# EasyEDA Pro project FLIGHT-CONTROLLER_VERSION-2.eprj

# Schematic FLIGHT CONTROLLER
Board Name: FLIGHT CONTROLLER; Create Date: 2025-07-11; Page Name: Sheet_1; Project Name: FLIGHT-CONTROLLER; Schematic Name: FLIGHT CONTROLLER; Update Date: 2025-07-13; Add into BOM: yes; Company: Your Company; Convert to PCB: yes; Date: 2025-07-08; Draw By: Jinalka Herath; REV: 1.0; Sheet: 1/1; spicePre: .
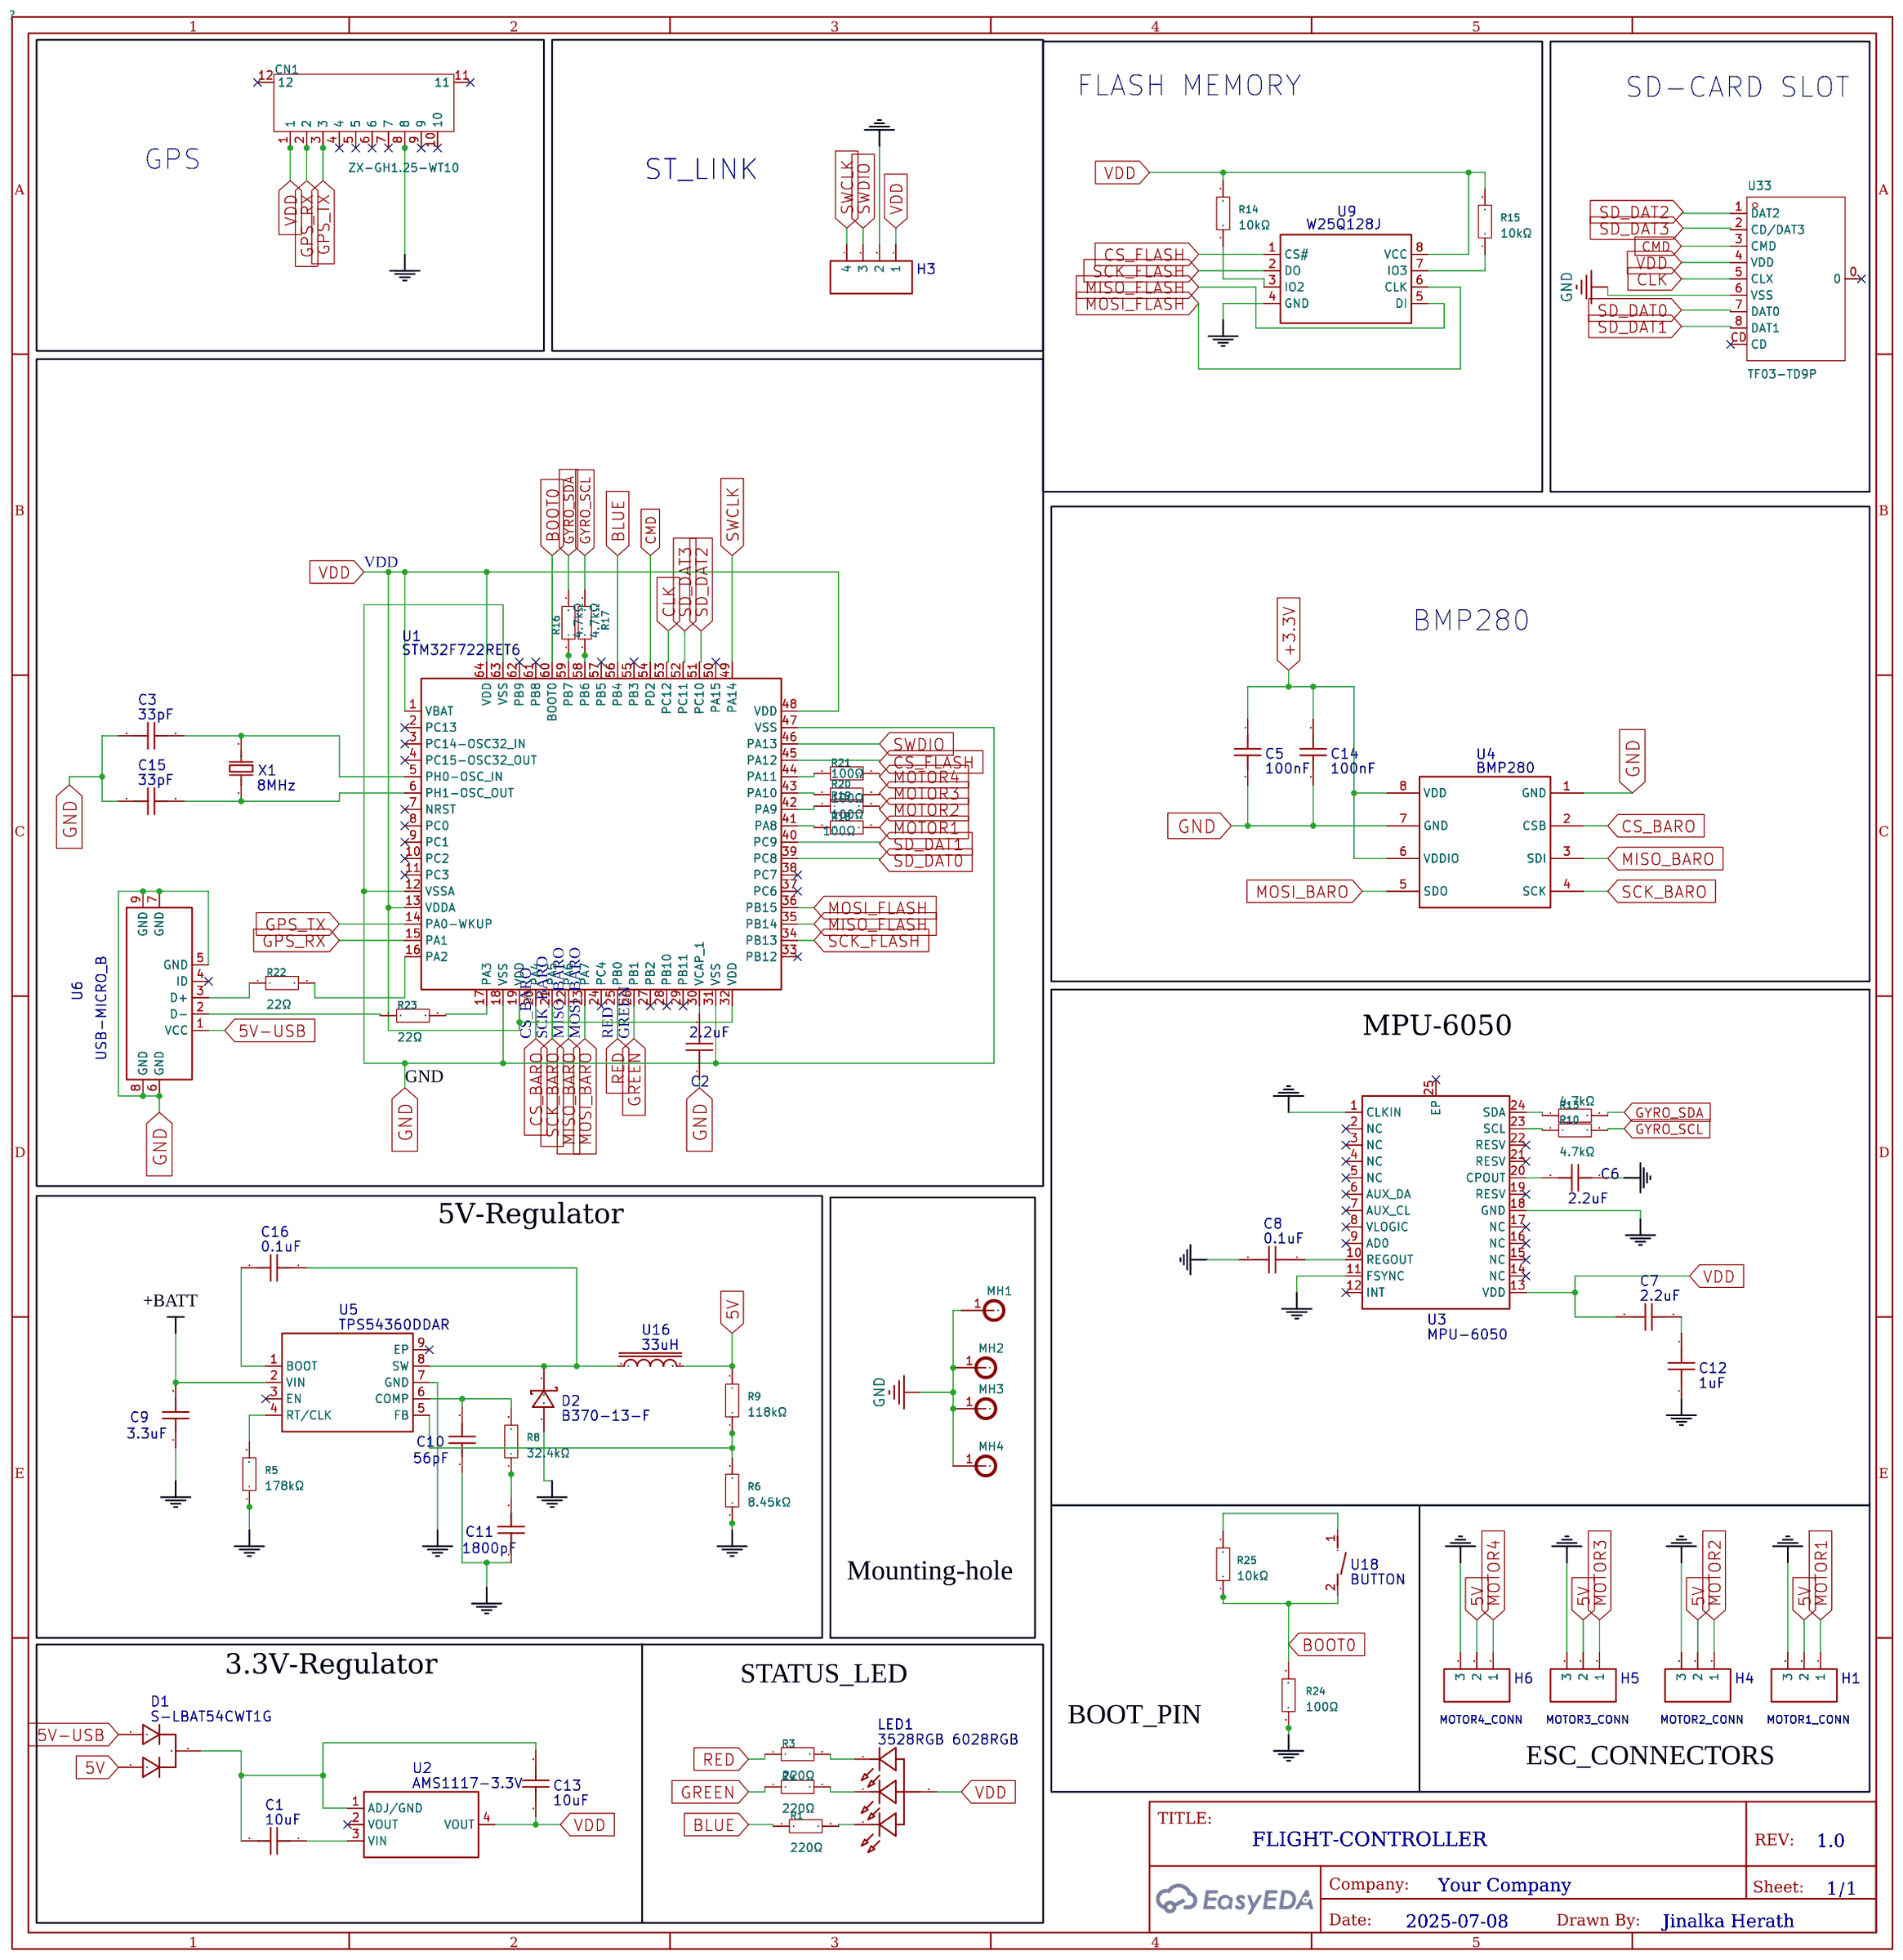
[diagram p0: schematic sheet]

## Parts
C1  10uF  [C0603]
C2  2.2uF  [CAP-SMD_L3.2-W2.5-1]
C3  33pF  [C0603]
C5  100nF  [C0603]
C6  2.2uF  [C0603]
C7  2.2uF  [C0603]
C8  0.1uF  [C0603]
C9  3.3uF  [C0603]
C10  56pF  [C0603]
C11  1800pF  [C0603]
C12  1uF  [C0603]
C13  10uF  [C0603]
C14  100nF  [C0603]
C15  33pF  [C0603]
C16  0.1uF  [C0603]
CN1  ZX-GH1.25-WT10  [CONN-SMD_ZX-GH1.25-WT10]
D1  S-LBAT54CWT1G  [SC-70-3_L2.0-W1.3-P1.30-LS2.1-BR]
D2  B370-13-F  [SMC_L7.1-W6.2-LS8.1-RD]
H1  MOTOR1_CONN  [HDR-F-2.54_1X3]
H3  ST_LINK  [HDR-F-2.54_1X4]
H4  MOTOR2_CONN  [HDR-F-2.54_1X3]
H5  MOTOR3_CONN  [HDR-F-2.54_1X3]
H6  MOTOR4_CONN  [HDR-F-2.54_1X3]
LED1  3528RGB 6028RGB  [LED-SMD_4P-L3.5-W2.8_3528RGB-6028RGB]
MH1  -  [MH_7.5]  (no BOM)
MH2  -  [MH_7.5]  (no BOM)
MH3  -  [MH_7.5]  (no BOM)
MH4  -  [MH_7.5]  (no BOM)
R1  220Ω  [R0805]
R3  220Ω  [R0805]
R4  220Ω  [R0805]
R5  178kΩ  [R0805]
R6  8.45kΩ  [R0805]
R8  32.4kΩ  [R0805]
R9  118kΩ  [R0805]
R10  4.7kΩ  [R0805]
R13  4.7kΩ  [R0805]
R14  10kΩ  [R0805]
R15  10kΩ  [R0805]
R16  4.7kΩ  [R0805]
R17  4.7kΩ  [R0805]
R18  100Ω  [R0805]
R19  100Ω  [R0805]
R20  100Ω  [R0805]
R21  100Ω  [R0805]
R22  22Ω  [R0805]
R23  22Ω  [R0805]
R24  100Ω  [R0805]
R25  10kΩ  [R0805]
U1  STM32F722RET6  [LQFP-64_L10.0-W10.0-P0.50-LS12.0-BL]
U2  AMS1117-3.3V  [SOT-223-4_L6.5-W3.5-P2.30-LS7.0-BR]
U3  MPU-6050  [QFN-24_L4.0-W4.0-P0.50-BL-EP2.7]
U4  BMP280  [LGA-8_L2.5-W2.0-P0.65_AMP6127]
U5  TPS54360DDAR  [ESOP-8_L4.9-W3.9-P1.27-LS6.0-BL-EP]
U6  USB-MICRO_B  [MICRO-USB-SMD_USB-MICRO_B]
U9  W25Q128J  [SOIC-8_L5.3-W5.3-P1.27-LS8.0-BL]
U16  33uH  [IND-SMD_L8.5-W8.0_SMS0850]
U18  BUTTON  [KEY-SMD_L6.0-W6.0-LS6.6]
U33  TF03-TD9P  [CONN-SMD_TF-001A-P]
X1  8MHz  [CRYSTAL-SMD_L3.2-W2.5_3225-8MHZ]

## Library data of the parts
C1 C13 = 10uF: Supplier: LCSC; Supplier Part: C3884822; Manufacturer: TDK; Manufacturer Part: C1608CH2A560J080AA; JLCPCB Part Class: Extended Part; Contributor: lcsc; nameAlias: Value; spicePre: C; spiceSymbolName: C1608CH2A560J080AA
C2 = 2.2uF: Supplier: LCSC; Supplier Part: C3778570; Manufacturer: rubycon(红宝石); Manufacturer Part: 25MU225MB23225; JLCPCB Part Class: Extended Part; Contributor: lcsc; nameAlias: Value; spicePre: C; spiceSymbolName: 25MU225MB23225
C3 C15 = 33pF: Supplier: LCSC; Supplier Part: C3884822; Manufacturer: TDK; Manufacturer Part: C1608CH2A560J080AA; JLCPCB Part Class: Extended Part; Contributor: lcsc; nameAlias: Value; spicePre: C; spiceSymbolName: C1608CH2A560J080AA
C5 C14 = 100nF: Supplier: LCSC; Supplier Part: C3884822; Manufacturer: TDK; Manufacturer Part: C1608CH2A560J080AA; JLCPCB Part Class: Extended Part; Contributor: lcsc; nameAlias: Value; spicePre: C; spiceSymbolName: C1608CH2A560J080AA
C6 C7 = 2.2uF: Supplier: LCSC; Supplier Part: C3884822; Manufacturer: TDK; Manufacturer Part: C1608CH2A560J080AA; JLCPCB Part Class: Extended Part; Contributor: lcsc; nameAlias: Value; spicePre: C; spiceSymbolName: C1608CH2A560J080AA
C8 C16 = 0.1uF: Supplier: LCSC; Supplier Part: C3884822; Manufacturer: TDK; Manufacturer Part: C1608CH2A560J080AA; JLCPCB Part Class: Extended Part; Contributor: lcsc; nameAlias: Value; spicePre: C; spiceSymbolName: C1608CH2A560J080AA
C9 = 3.3uF: Supplier: LCSC; Supplier Part: C3884822; Manufacturer: TDK; Manufacturer Part: C1608CH2A560J080AA; JLCPCB Part Class: Extended Part; Contributor: lcsc; nameAlias: Value; spicePre: C; spiceSymbolName: C1608CH2A560J080AA
C10 = 56pF: Supplier: LCSC; Supplier Part: C3884822; Manufacturer: TDK; Manufacturer Part: C1608CH2A560J080AA; JLCPCB Part Class: Extended Part; Contributor: lcsc; nameAlias: Value; spicePre: C; spiceSymbolName: C1608CH2A560J080AA
C11 = 1800pF: Supplier: LCSC; Supplier Part: C3884822; Manufacturer: TDK; Manufacturer Part: C1608CH2A560J080AA; JLCPCB Part Class: Extended Part; Contributor: lcsc; nameAlias: Value; spicePre: C; spiceSymbolName: C1608CH2A560J080AA
C12 = 1uF: Supplier: LCSC; Supplier Part: C3884822; Manufacturer: TDK; Manufacturer Part: C1608CH2A560J080AA; JLCPCB Part Class: Extended Part; Contributor: lcsc; nameAlias: Value; spicePre: C; spiceSymbolName: C1608CH2A560J080AA
CN1 = ZX-GH1.25-WT10: Pins Structure:1x10P Pitch:1.25mm Mounting Type:Surface Mount, Right Angle Reference Series:GH Number of Pins:10P Number of Rows:1 Number of PINs Per Row:10 Row Spacing:- Current Rating:1A Contact Material:Phosphor Bronze Contact Plating:Tin Operating Tem; LCSC Part Name: 1x10P 间距:1.25mm 卧贴 系列:GH; Supplier Part: C7429523; Manufacturer: Megastar(兆星); Supplier Footprint: SMD,P=1.25mm,卧贴; JLCPCB Part Class: Extended Part; Datasheet: https://atta.szlcsc.com/upload/public/pdf/source/20230619/4B2B28B10338DA0EF18CC8BF26211619.pdf; Supplier: LCSC; Pins Structure: 1x10P; Pitch: 1.25mm; Mounting Type: Surface Mount, Right Angle; Reference Series: GH; Number of Pins: 10P; Number of Rows: 1; Number of PINs Per Row: 10; Current Rating: 1A; Contact Material: Phosphor Bronze; Contact Plating: Tin; Operating Temperature: -25℃~+85℃; Voltage Rating: 125V; Plastic Material: LCP; Supplementary Features: Auxiliary Solder Pin; Color: Beige; Z-Height of the Board: 4.35mm; X-Length of Bottom Edge on Board (Spacing Line): 15.75mm; Y-Width of Bottom Edge on Board: 5mm
D1 = S-LBAT54CWT1G: Supplier: LCSC; Supplier Part: C2941716; Manufacturer: LRC(乐山无线电); JLCPCB Part Class: Extended Part; Contributor: lcsc; spicePre: D
D2 = B370-13-F: Supplier Part: C134456; Supplier: LCSC; Manufacturer: DIODES(美台); JLCPCB Part Class: Extended Part; Contributor: LCSC; spicePre: D
H1 = MOTOR1_CONN: Supplier Part: C146690; Supplier: LCSC; Contributor: LCEDA_Lib; spicePre: H; spiceSymbolName: HDR-F-2.54_1x3
H3 = ST_LINK: Supplier Part: C225501; Supplier: LCSC; Contributor: LCEDA_Lib; spicePre: H; spiceSymbolName: HDR-F-2.54_1x4
H4 = MOTOR2_CONN: Supplier Part: C146690; Supplier: LCSC; Contributor: LCEDA_Lib; spicePre: H; spiceSymbolName: HDR-F-2.54_1x3
H5 = MOTOR3_CONN: Supplier Part: C146690; Supplier: LCSC; Contributor: LCEDA_Lib; spicePre: H; spiceSymbolName: HDR-F-2.54_1x3
H6 = MOTOR4_CONN: Supplier Part: C146690; Supplier: LCSC; Contributor: LCEDA_Lib; spicePre: H; spiceSymbolName: HDR-F-2.54_1x3
LED1 = 3528RGB 6028RGB: Supplier: LCSC; Supplier Part: C9900020542; Manufacturer: null; Manufacturer Part: 3528反贴RGB 6028反贴RGB 缺口蓝色; JLCPCB Part Class: Extended Part; Contributor: lcsc; spicePre: L
MH1-MH4 = MH_7.5
R1 R3-R6 R8-R10 R13-R25 = 0805W8F2200T5E: Type:Thick Film Resistors Resistance: Tolerance:±1% Tolerance:±1% Power(Watts): Overload Voltage (Max): Temperature Coefficient:±100ppm/℃ Temperature Coefficient:±100ppm/℃ Operating Temperature Range:-55℃~+155℃ Operating Temperature Range:-55℃~+155℃; LCSC Part Name: 220Ω ±1% 125mW 厚膜电阻; Supplier Part: C17557; Manufacturer: UNI-ROYAL(厚声); Supplier Footprint: 0805; JLCPCB Part Class: Basic Part; Datasheet: https://atta.szlcsc.com/upload/public/pdf/source/20200306/C422600_1E6D84923E4A46A82E41ADD87F860B5C.pdf; Supplier: LCSC; Type: Thick Film Resistors; Tolerance: ±1%; Temperature Coefficient: ±100ppm/℃; Operating Temperature Range: -55℃~+155℃
U1 = STM32F722RET6: Supplier: LCSC; Supplier Part: C118207; Manufacturer: ST(意法半导体); JLCPCB Part Class: Extended Part; Contributor: LCSC; spicePre: U
U2 = AMS1117-3.3V: Supplier: LCSC; Supplier Part: C2688239; Manufacturer: WPMtek(维攀); JLCPCB Part Class: Extended Part; Contributor: LCSC; spicePre: U
U3 = MPU-6050_C24112: Supplier: LCSC; Manufacturer: TDK InvenSense(应美盛); Supplier Part: C24112; JLCPCB Part Class: Extended Part; sourceId: 1T5FDZYC8; timeStamp: 1462265206; spicePre: U
U4 = BMP280: Supplier: LCSC; Manufacturer: Bosch(博世); Supplier Part: C83291; JLCPCB Part Class: Extended Part; spicePre: U
U5 = TPS54360DDAR(TOKMAS): Supplier: LCSC; Supplier Part: C7525413; Manufacturer: Tokmas(托克马斯); JLCPCB Part Class: Extended Part; Contributor: lcsc; spicePre: U
U6 = USB-MICRO_B: Supplier: LCSC; Supplier Part: C9900001367; Manufacturer: null; JLCPCB Part Class: Extended Part; Contributor: LCSC; spicePre: U
U9 = W25Q128JVSIQTR: Supplier: LCSC; Manufacturer: WINBOND(华邦); Manufacturer Part: W25Q128JVSIQ; Supplier Part: C97521; JLCPCB Part Class: Basic Part; spicePre: U
U16 = 33uH: Supplier: LCSC; Supplier Part: C7602869; Manufacturer: LanTu Micro(蓝图微电); Manufacturer Part: SMS0850-330MT; JLCPCB Part Class: Extended Part; nameAlias: Value; Contributor: lcsc; spicePre: U; spiceSymbolName: SMS0850-330MT
U18 = BUTTON: Supplier: LCSC; Supplier Part: C9900040040; Manufacturer: null; JLCPCB Part Class: Extended Part; Contributor: lcsc; spicePre: U; spiceSymbolName: BUTTON_C9900040040
U33 = TF03-TD9P: LCSC Part Name: 自弹式 MicroSD(TF卡）卡座; Supplier Part: C36936584; Manufacturer: BXCONN(宝讯); Supplier Footprint: SMD; Datasheet: https://atta.szlcsc.com/upload/public/pdf/source/20240731/E1986EBDAECF71B60F867BC7213E5175.pdf; Supplier: LCSC
X1 = 8MHz: Supplier: LCSC; Supplier Part: C42448903; Manufacturer: YXC(扬兴晶振); Manufacturer Part: X22EL89COI-111YLC-8M; JLCPCB Part Class: Extended Part; Contributor: lcsc; nameAlias: Value; spicePre: X; spiceSymbolName: X22EL89COI-111YLC-8M

## Nets
5V: D1.2 H1.2 H4.2 H5.2 H6.2 R9.2 U16.2
5V-USB: D1.1 U6.1(VCC)
+3.3V: C5.1 C14.1 U4.6(VDDIO) U4.8(VDD)
GND: C2.1 C3.1 C5.2 C6.1 C8.2 C9.1 C10.1 C11.1 C12.2 C14.2 C15.1 CN1.8 D2.2(A) H1.3 H3.2 H4.3 H5.3 H6.3 MH1.1 MH2.1 MH3.1 MH4.1 R5.1 R6.1 R24.1 U1.12(VSSA) U1.18(VSS) U1.31(VSS) U1.47(VSS) U1.63(VSS) U3.1(CLKIN) U3.11(FSYNC) U3.18(GND) U4.1(GND) U4.7(GND) U5.7(GND) U6.5(GND) U6.6(GND) U6.7(GND) U6.8(GND) U6.9(GND) U9.4(GND) U33.6(VSS)
VDD: C7.2 C13.2 CN1.1 H3.1 LED1.3(A) R14.2 R15.2 U1.1(VBAT) U1.13(VDDA) U1.19(VDD) U1.32(VDD) U1.48(VDD) U1.64(VDD) U2.4(VOUT) U3.13(VDD) U9.8(VCC) U33.4(VDD)
+BATT: C9.2 U5.2(VIN)
BLUE: R1.1 U1.56(PB4)
BOOT0: R24.2 R25.1 U1.60(BOOT0) U18.2(B)
CLK: U1.53(PC12) U33.5(CLX)
CMD: U1.54(PD2) U33.3(CMD)
CS_BARO: U1.20(PA4) U4.2(CSB)
CS_FLASH: U1.45(PA12) U9.1(CS#)
GPS_RX: CN1.2 U1.15(PA1)
GPS_TX: CN1.3 U1.14(PA0-WKUP)
GREEN: R4.1 U1.26(PB1)
GYRO_SCL: R10.2 R17.2
GYRO_SDA: R13.2 R16.2
MISO_BARO: U1.22(PA6) U4.3(SDI)
MISO_FLASH: U1.35(PB14) U9.5(DI)
MOSI_BARO: U1.23(PA7) U4.5(SDO)
MOSI_FLASH: U1.36(PB15) U9.6(CLK)
MOTOR1: H1.1 R18.2
MOTOR2: H4.1 R19.2
MOTOR3: H5.1 R20.2
MOTOR4: H6.1 R21.2
RED: R3.1 U1.25(PB0)
SCK_BARO: U1.21(PA5) U4.4(SCK)
SCK_FLASH: U1.34(PB13) U9.2(DO)
SD_DAT0: U1.39(PC8) U33.7(DAT0)
SD_DAT1: U1.40(PC9) U33.8(DAT1)
SD_DAT2: U1.51(PC10) U33.1(DAT2)
SD_DAT3: U1.52(PC11) U33.2(CD/DAT3)
SWCLK: H3.4 U1.49(PA14)
SWDIO: H3.3 U1.46(PA13)
$1N7: C2.2 U1.30(VCAP_1)
$1N9: C3.2 U1.5(PH0-OSC_IN) X1.2
$1N10: C15.2 U1.6(PH1-OSC_OUT) X1.1
$1N15: C8.1 U3.10(REGOUT)
$1N18: C7.1 C12.1
$1N20: C6.2 U3.20(CPOUT)
$1N23: C1.2 C13.1 D1.3 U2.1(ADJ/GND)
$1N24: C1.1 U2.3(VIN)
$1N83: C16.2 U5.1(BOOT)
$1N84: C16.1 D2.1(C) U5.8(SW) U16.1
Net-(C10-2): C10.2 R8.2 U5.6(COMP)
Net-(C11-2): C11.2 R8.1
Net-(LED1-1): LED1.1(B) R4.2
Net-(LED1-2): LED1.2(R) R3.2
Net-(LED1-4): LED1.4(G) R1.2
Net-(R5-2): R5.2 U5.4(RT/CLK)
Net-(R6-2): R6.2 R9.1 U5.5(FB)
Net-(R10-1): R10.1 U3.23(SCL)
Net-(R13-1): R13.1 U3.24(SDA)
Net-(R14-1): R14.1 U9.3(IO2)
Net-(R15-1): R15.1 U9.7(IO3)
Net-(R16-1): R16.1 U1.59(PB7)
Net-(R17-1): R17.1 U1.58(PB6)
Net-(R18-1): R18.1 U1.41(PA8)
Net-(R19-1): R19.1 U1.42(PA9)
Net-(R20-1): R20.1 U1.43(PA10)
Net-(R21-1): R21.1 U1.44(PA11)
Net-(R22-1): R22.1 U6.3(D+)
Net-(R22-2): R22.2 U1.16(PA2)
Net-(R23-1): R23.1 U6.2(D-)
Net-(R23-2): R23.2 U1.17(PA3)
Net-(R25-2): R25.2 U18.1(A)

Not connected (* = marked no-connect by the designer): CN1 4* 5* 6* 7* 9* 10* 11* 12*; U1 2(PC13)* 3(PC14-OSC32_IN)* 4(PC15-OSC32_OUT)* 7(NRST)* 8(PC0)* 9(PC1)* 10(PC2)* 11(PC3)* 24(PC4)* 27(PB2)* 28(PB10)* 29(PB11)* 33(PB12)* 37(PC6)* 38(PC7)* 50(PA15)* 55(PB3)* 57(PB5)* 61(PB8)* 62(PB9)*; U2 2(VOUT)*; U3 2(NC)* 3(NC)* 4(NC)* 5(NC)* 6(AUX_DA)* 7(AUX_CL)* 8(VLOGIC)* 9(AD0)* 12(INT)* 14(NC)* 15(NC)* 16(NC)* 17(NC)* 19(RESV)* 21(RESV)* 22(RESV)* 25(EP)*; U5 3(EN)* 9(EP)*; U6 4(ID)*; U33 0* CD*

## Notes on the sheet
- FLASH MEMORY
- SD-CARD SLOT
- GPS
- BMP280
- MPU-6050
- 5V-Regulator
- +BATT
- Mounting-hole
- 3.3V-Regulator
- STATUS_LED
- BOOT_PIN
- ESC_CONNECTORS

# Board PCB4
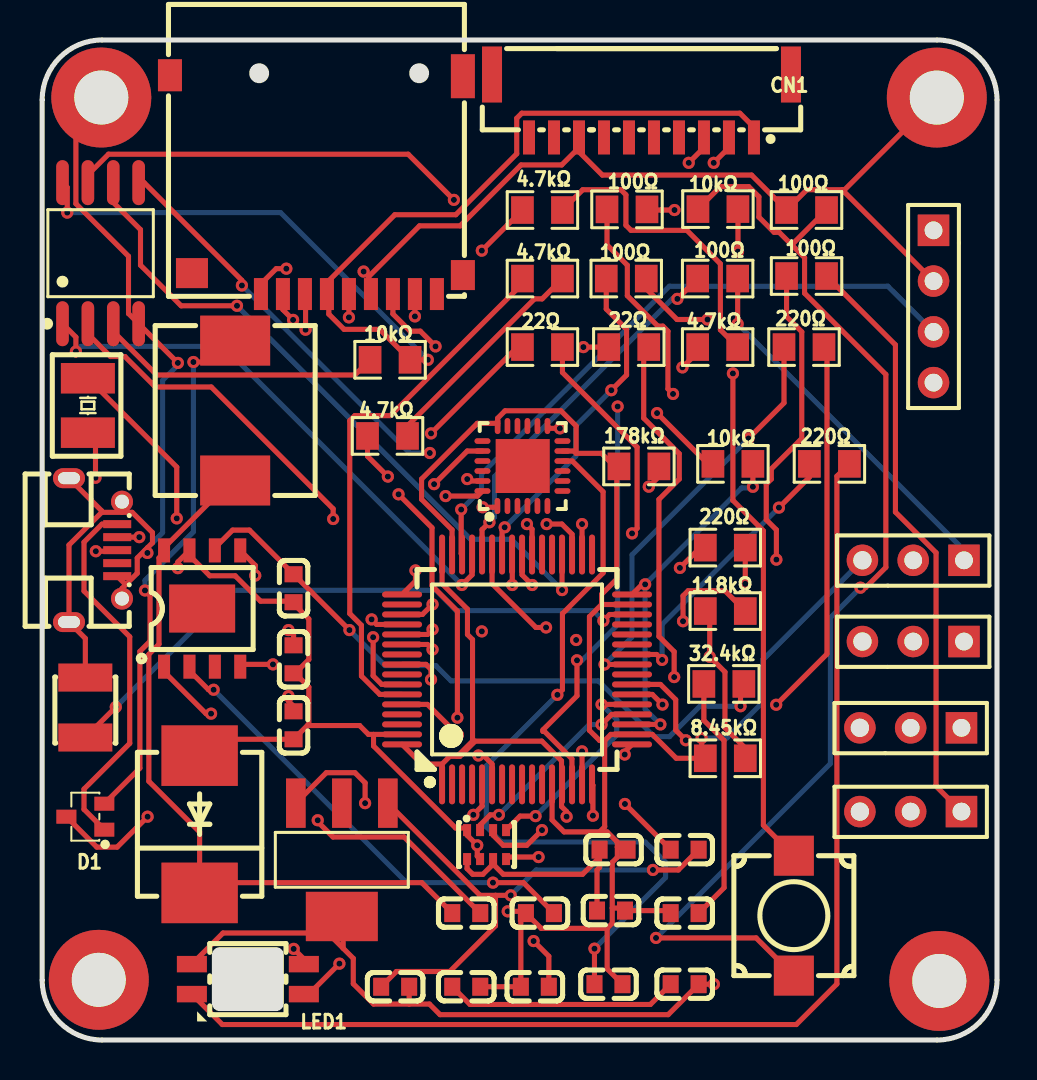
[diagram p1: board, top side]
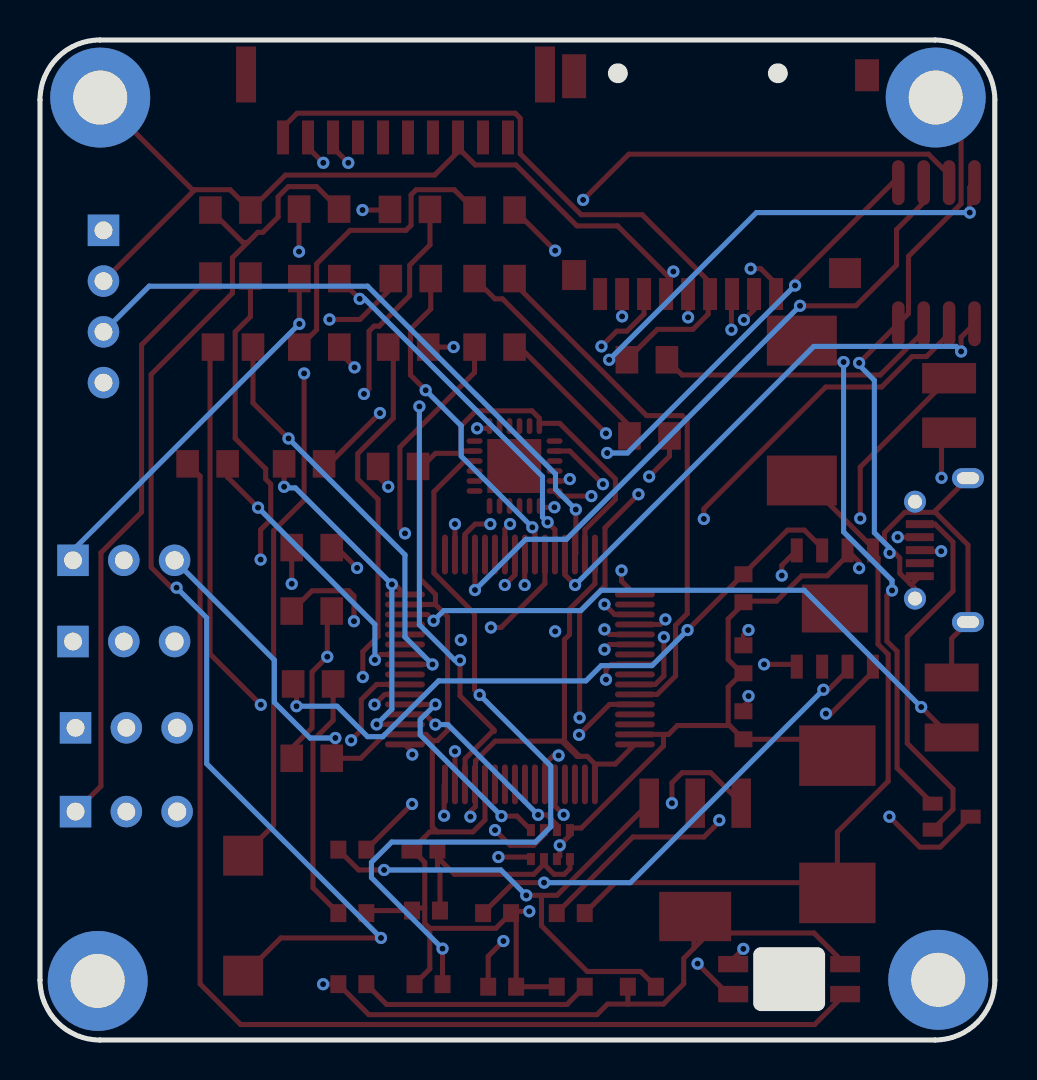
[diagram p2: board, bottom side, seen from below]

Outline 47.75 x 50.04 mm; copper layers: Top Layer, Inner1, Inner2, Bottom Layer. Coordinates in mm from the lower left corner of the outline.
Outline path: 0,47.04 0,3 arc(0.88,0.88) 3,0 44.75,0 arc(46.87,0.88) 47.75,3 47.75,47.04 arc(46.87,49.16) 44.75,50.04 3,50.04 arc(0.88,49.16) 0,47.04
Stack: Top Layer 0.035mm Outer layer thickness 1oz / Dielectric1 0.2104mm 7628 RC49% 8.6mil / Inner1 0.0152mm Inner layer thickness / Dielectric2 1.065mm 1.1mm H/HOZ Copper / Inner2 0.0152mm Inner layer thickness / Dielectric3 0.2104mm 7628 RC49% 8.6mil / Bottom Layer 0.035mm Outer layer thickness 1oz

## Design rules (mm)
template: JLCPCB Capability(Two Layers Board)
spacing copperThickness1oz (default): track to track 0.102, other pairs 0.152 to 0.3
spacing copperThickness2oz: track to track 0.203, other pairs 0.152 to 0.3
track width copperThickness1oz (default): min 0.127, default 0.254, max 2.54
track width copperThickness2oz: min 0.203, default 0.254, max 2.54
differential pair differentialPair (default): width min 0.127, default 0.254, max 2.54; gap min 0.152, default 0.152
via viaSize (default): diameter min 0.5, default 0.61, max 10; hole min 0.3, default 0.305, max 6.3
pour e16520 uses copperRegion

## Placement (name value [footprint] x y rotation side)
4.7kΩ  -  [R0805]  33.78 34.67 0 top
4.7kΩ#2  -  [R0805]  17.27 30.23 0 top
4.7kΩ#3  -  [R0805]  25.02 38.1 0 top
4.7kΩ#4  -  [R0805]  25.02 41.53 0 top
8.45kΩ  8.45kΩ  [R0805]  34.16 14.1 0 top
10kΩ  -  [R0805]  17.4 34.04 0 top
10kΩ#2  -  [R0805]  34.54 28.83 0 top
10kΩ#3  -  [R0805]  33.8 41.58 0 top
22Ω  -  [R0805]  29.34 34.67 0 top
22Ω#2  -  [R0805]  25.02 34.67 0 top
32.4kΩ  32.4kΩ  [R0805]  34.09 17.82 0 top
100Ω  -  [R0805]  38.23 38.23 0 top
100Ω#2  -  [R0805]  29.21 38.1 0 top
100Ω#3  -  [R0805]  29.25 41.56 0 top
100Ω#4  -  [R0805]  33.78 38.1 0 top
100Ω#5  -  [R0805]  38.23 41.53 0 top
118kΩ  118kΩ  [R0805]  34.16 21.46 0 top
178kΩ  178kΩ  [R0805]  29.85 28.7 0 top
220Ω  -  [R0805]  34.16 24.64 0 top
220Ω#2  -  [R0805]  38.1 34.67 0 top
220Ω#3  -  [R0805]  39.37 28.83 0 top
C1  10uF  [C0603]  32.13 9.53 0 top
C2  2.2uF  [CAP-SMD_L3.2-W2.5-1]  2.16 16.64 270 top
C3  33pF  [C0603]  12.57 19.05 90 top
C5  100nF  [C0603]  28.45 6.48 0 top
C6  2.2uF  [C0603]  24.64 2.67 0 top
C7  2.2uF  [C0603]  32.13 2.79 0 top
C8  0.1uF  [C0603]  28.32 2.79 0 top
C9  3.3uF  [C0603]  24.89 6.35 0 top
C10  56pF  [C0603]  12.57 22.61 90 top
C11  1800pF  [C0603]  32.13 6.35 0 top
C12  1uF  [C0603]  21.21 2.67 0 top
C13  10uF  [C0603]  17.65 2.67 0 top
C14  100nF  [C0603]  28.58 9.53 0 top
C15  33pF  [C0603]  12.57 15.75 90 top
C16  0.1uF  [C0603]  21.21 6.35 0 top
CN1  ZX-GH1.25-WT10  [CONN-SMD_ZX-GH1.25-WT10]  29.97 46.74 180 top
D1  S-LBAT54CWT1G  [SC-70-3_L2.0-W1.3-P1.30-LS2.1-BR]  2.16 11.18 0 top
D2  B370-13-F  [SMC_L7.1-W6.2-LS8.1-RD]  7.87 10.8 90 top
H1  MOTOR1_CONN  [HDR-F-2.54_1X3]  43.43 11.43 180 top
H3  ST_LINK  [HDR-F-2.54_1X4]  44.58 36.7 270 top
H4  MOTOR2_CONN  [HDR-F-2.54_1X3]  43.43 15.62 180 top
H5  MOTOR3_CONN  [HDR-F-2.54_1X3]  43.56 19.94 180 top
H6  MOTOR4_CONN  [HDR-F-2.54_1X3]  43.56 24 180 top
LED1  3528RGB 6028RGB  [LED-SMD_4P-L3.5-W2.8_3528RGB-6028RGB]  10.29 3.05 0 top
MH1  -  [MH_7.5]  2.96 47.54 0 top
MH2  -  [MH_7.5]  44.74 47.54 0 top
MH3  -  [MH_7.5]  44.87 3.34 0 top
MH4  -  [MH_7.5]  2.83 3.39 0 top
U1  STM32F722RET6  [LQFP-64_L10.0-W10.0-P0.50-LS12.0-BL]  23.75 18.54 0 top
U2  AMS1117-3.3V  [SOT-223-4_L6.5-W3.5-P2.30-LS7.0-BR]  14.99 9.02 90 top
U3  MPU-6050  [QFN-24_L4.0-W4.0-P0.50-BL-EP2.7]  24.02 28.72 0 top
U4  BMP280  [LGA-8_L2.5-W2.0-P0.65_AMP6127]  22.23 9.78 90 top
U5  TPS54360DDAR  [ESOP-8_L4.9-W3.9-P1.27-LS6.0-BL-EP]  8 21.59 0 top
U6  USB-MICRO_B  [MICRO-USB-SMD_USB-MICRO_B]  2.67 24.51 270 top
U9  W25Q128J  [SOIC-8_L5.3-W5.3-P1.27-LS8.0-BL]  2.92 39.37 0 top
U16  33uH  [IND-SMD_L8.5-W8.0_SMS0850]  9.65 31.5 90 top
U18  BUTTON  [KEY-SMD_L6.0-W6.0-LS6.6]  37.59 6.22 270 top
U33  TF03-TD9P  [CONN-SMD_TF-001A-P]  13.72 42.8 180 top
X1  8MHz  [CRYSTAL-SMD_L3.2-W2.5_3225-8MHZ]  2.29 31.75 90 top

## Footprints (pads in the part's own frame, mm; a bottom-side part is the same pattern mirrored in y, then rotated)
C0603
  rect 0.8x0.9 smd: 1(-0.7,0) 2(0.7,0)
CAP-SMD_L3.2-W2.5-1
  rect 1.4x2.7 smd: 1(-1.5,0) 2(1.5,0)
CONN-SMD_TF-001A-P
  rect 1.2x1.5 smd: 0(-7.325,4.524)
  rect 1.2x2.2 smd: 0(-7.325,-5.426)
  rect 1.6x1.5 smd: 0(6.225,4.426)
  rect 1.2x1.6 smd: 0(7.325,-5.474)
  rect 0.7x1.6 smd: 1(2.775,5.474) 2(1.675,5.474) 3(0.575,5.474) 4(-0.525,5.474) 5(-1.625,5.474) 6(-2.725,5.474) 7(-3.825,5.474) 8(-4.925,5.474) CD(-6.025,5.474)
CONN-SMD_ZX-GH1.25-WT10
  rect 0.6x1.7 smd: 1(-5.625,1.575) 2(-4.375,1.575) 3(-3.125,1.575) 4(-1.875,1.575) 5(-0.625,1.575) 6(0.625,1.575) 7(1.875,1.575) 8(3.125,1.575) 9(4.375,1.575) 10(5.625,1.575)
  rect 1x2.8 smd: 11(7.475,-1.575) 12(-7.475,-1.575)
CRYSTAL-SMD_L3.2-W2.5_3225-8MHZ
  rect 1.524x2.7 smd: 1(-1.362,0) 2(1.362,0)
ESOP-8_L4.9-W3.9-P1.27-LS6.0-BL-EP
  rect 0.6x1.2 smd: 1(-1.905,-2.909) 2(-0.635,-2.909) 3(0.635,-2.909) 4(1.905,-2.909) 5(1.905,2.909) 6(0.635,2.909) 7(-0.635,2.909) 8(-1.905,2.909)
  rect 3.3x2.4 smd: 9(0,0)
HDR-F-2.54_1X3
  rect 1.575x1.575 hole 0.889: 1(-2.54,0)
  round 1.575 hole 0.889: 2(0,0)
  round 1.575 hole 0.914: 3(2.54,0)
HDR-F-2.54_1X4
  rect 1.575x1.575 hole 0.889: 1(-3.81,0)
  round 1.575 hole 0.889: 2(-1.27,0) 3(1.27,0) 4(3.81,0)
IND-SMD_L8.5-W8.0_SMS0850
  rect 2.5x3.5 smd: 1(-3.5,0) 2(3.5,0)
KEY-SMD_L6.0-W6.0-LS6.6
  rect 2x2 smd: 1(-3,0) 2(3,0)
LED-SMD_4P-L3.5-W2.8_3528RGB-6028RGB
  rect 1.5x0.82 smd: 1(-2.8,-0.75) 2(2.8,-0.75) 3(-2.8,0.75) 4(2.8,0.75)
LGA-8_L2.5-W2.0-P0.65_AMP6127
  rect 0.6x0.4 smd: 1(0.725,0.975) 2(0.725,0.325) 3(0.725,-0.325) 4(0.725,-0.975) 5(-0.725,-0.975) 6(-0.725,-0.325) 7(-0.725,0.325) 8(-0.725,0.975)
LQFP-64_L10.0-W10.0-P0.50-LS12.0-BL
  oval 0.3x2 smd: 1(-3.75,-5.75) 2(-3.25,-5.75) 3(-2.75,-5.75) 4(-2.25,-5.75) 5(-1.75,-5.75) 6(-1.25,-5.75) 7(-0.75,-5.75) 8(-0.25,-5.75) 9(0.25,-5.75) 10(0.75,-5.75) 11(1.25,-5.75) 12(1.75,-5.75) 13(2.25,-5.75) 14(2.75,-5.75) 15(3.25,-5.75) 16(3.75,-5.75) 33(3.75,5.75) 34(3.25,5.75) 35(2.75,5.75) 36(2.25,5.75) 37(1.75,5.75) 38(1.25,5.75) 39(0.75,5.75) 40(0.25,5.75) 41(-0.25,5.75) 42(-0.75,5.75) 43(-1.25,5.75) 44(-1.75,5.75) 45(-2.25,5.75) 46(-2.75,5.75) 47(-3.25,5.75) 48(-3.75,5.75)
  oval 2x0.3 smd: 17(5.75,-3.75) 18(5.75,-3.25) 19(5.75,-2.75) 20(5.75,-2.25) 21(5.75,-1.75) 22(5.75,-1.25) 23(5.75,-0.75) 24(5.75,-0.25) 25(5.75,0.25) 26(5.75,0.75) 27(5.75,1.25) 28(5.75,1.75) 29(5.75,2.25) 30(5.75,2.75) 31(5.75,3.25) 32(5.75,3.75) 49(-5.75,3.75) 50(-5.75,3.25) 51(-5.75,2.75) 52(-5.75,2.25) 53(-5.75,1.75) 54(-5.75,1.25) 55(-5.75,0.75) 56(-5.75,0.25) 57(-5.75,-0.25) 58(-5.75,-0.75) 59(-5.75,-1.25) 60(-5.75,-1.75) 61(-5.75,-2.25) 62(-5.75,-2.75) 63(-5.75,-3.25) 64(-5.75,-3.75)
MH_7.5
  round 5 hole 2.7: 1(0,-0.381)
MICRO-USB-SMD_USB-MICRO_B
  rect 0.4x1.4 smd: 1(-1.3,1.086) 2(-0.65,1.086) 3(0,1.086) 4(0.65,1.086) 5(1.3,1.086)
  oval 1x1.6 hole 0.6x1.1: 6(3.6,-1.325) 7(-3.6,-1.325)
  round 1.1 hole 0.7: 8(2.425,1.325) 9(-2.425,1.325)
QFN-24_L4.0-W4.0-P0.50-BL-EP2.7
  oval 0.28x0.8 smd: 1(-1.25,-2) 2(-0.75,-2) 3(-0.25,-2) 4(0.25,-2) 5(0.75,-2) 6(1.25,-2) 13(1.25,2) 14(0.75,2) 15(0.25,2) 16(-0.25,2) 17(-0.75,2) 18(-1.242,2)
  oval 0.8x0.28 smd: 7(2,-1.25) 8(2,-0.75) 9(2,-0.25) 10(2,0.25) 11(2,0.75) 12(2,1.25) 19(-2,1.25) 20(-2,0.75) 21(-2,0.25) 22(-2,-0.25) 23(-2,-0.75) 24(-2,-1.25)
  rect 2.7x2.7 smd: 25(0.013,0)
R0805
  rect 1.133x1.377 smd: 1(-1,0) 2(1,0)
SC-70-3_L2.0-W1.3-P1.30-LS2.1-BR
  rect 1x0.7 smd: 1(0.95,-0.65) 2(0.95,0.65) 3(-0.95,-0.001)
SMC_L7.1-W6.2-LS8.1-RD
  rect 3.03x3.82 smd: 1(-3.435,0) 2(3.435,0)
SOIC-8_L5.3-W5.3-P1.27-LS8.0-BL
  oval 0.63x2.25 smd: 1(-1.905,-3.53) 2(-0.635,-3.53) 3(0.635,-3.53) 4(1.905,-3.53) 5(1.905,3.53) 6(0.635,3.53) 7(-0.635,3.53) 8(-1.905,3.53)
SOT-223-4_L6.5-W3.5-P2.30-LS7.0-BR
  rect 2.47x0.98 smd: 1(2.835,-2.3) 2(2.835,0) 3(2.835,2.3)
  rect 2.47x3.6 smd: 4(-2.835,0)

## Nets
5V: 118kΩ.2 D1.2 H1.2 H4.2 H5.2 H6.2 U16.2
5V-USB: D1.1 U6.1
+3.3V: C5.1 C14.1 U4.6 U4.8
GND: 8.45kΩ.1 100Ω#5.1 178kΩ.1 C2.1 C3.1 C5.2 C6.1 C8.2 C9.1 C10.1 C11.1 C12.2 C14.2 C15.1 CN1.8 D2.2 H1.3 H3.2 H4.3 H5.3 H6.3 MH1.1 MH2.1 MH3.1 MH4.1 U1.12 U1.18 U1.31 U1.47 U1.63 U3.1 U3.11 U3.18 U4.1 U4.7 U5.7 U6.5 U6.6 U6.7 U6.8 U6.9 U9.4 U33.6
VDD: 10kΩ.2 10kΩ#2.2 C7.2 C13.2 CN1.1 H3.1 LED1.3 U1.1 U1.13 U1.19 U1.32 U1.48 U1.64 U2.4 U3.13 U9.8 U33.4
+BATT: C9.2 U5.2
BLUE: 220Ω.1 U1.56
BOOT0: 10kΩ#3.1 100Ω#5.2 U1.60 U18.2
CLK: U1.53 U33.5
CMD: U1.54 U33.3
CS_BARO: U1.20 U4.2
CS_FLASH: U1.45 U9.1
GPS_RX: CN1.2 U1.15
GPS_TX: CN1.3 U1.14
GREEN: 220Ω#3.1 U1.26
GYRO_SCL: 4.7kΩ.2 4.7kΩ#4.2
GYRO_SDA: 4.7kΩ#2.2 4.7kΩ#3.2
MISO_BARO: U1.22 U4.3
MISO_FLASH: U1.35 U9.5
MOSI_BARO: U1.23 U4.5
MOSI_FLASH: U1.36 U9.6
MOTOR1: 100Ω.2 H1.1
MOTOR2: 100Ω#2.2 H4.1
MOTOR3: 100Ω#3.2 H5.1
MOTOR4: 100Ω#4.2 H6.1
RED: 220Ω#2.1 U1.25
SCK_BARO: U1.21 U4.4
SCK_FLASH: U1.34 U9.2
SD_DAT0: U1.39 U33.7
SD_DAT1: U1.40 U33.8
SD_DAT2: U1.51 U33.1
SD_DAT3: U1.52 U33.2
SWCLK: H3.4 U1.49
SWDIO: H3.3 U1.46
$1N1: 22Ω#2.2 U1.17
$1N2: 22Ω#2.1 U6.2
$1N3: 22Ω.2 U1.16
$1N4: 22Ω.1 U6.3
$1N7: C2.2 U1.30
$1N9: C3.2 U1.5 X1.2
$1N10: C15.2 U1.6 X1.1
$1N15: C8.1 U3.10
$1N18: C7.1 C12.1
$1N20: C6.2 U3.20
$1N23: C1.2 C13.1 D1.3 U2.1
$1N24: C1.1 U2.3
$1N49: 10kΩ.1 U9.3
$1N50: 10kΩ#2.1 U9.7
$1N54: 100Ω#2.1 U1.42
$1N55: 100Ω#3.1 U1.43
$1N56: 100Ω#4.1 U1.44
$1N58: 4.7kΩ#2.1 U3.24
$1N60: 4.7kΩ.1 U3.23
$1N63: 4.7kΩ#4.1 U1.58
$1N64: 4.7kΩ#3.1 U1.59
$1N71: 100Ω.1 U1.41
$1N83: C16.2 U5.1
$1N84: C16.1 D2.1 U5.8 U16.1
$1N87: 32.4kΩ.2 C10.2 U5.6
$1N88: 32.4kΩ.1 C11.2
$1N90: 178kΩ.2 U5.4
$1N93: 8.45kΩ.2 118kΩ.1 U5.5
$1N107: 10kΩ#3.2 U18.1
$1N112: 220Ω#2.2 LED1.2
$1N113: 220Ω#3.2 LED1.1
$1N114: 220Ω.2 LED1.4

Pads without a net: CN1 4 5 6 7 9 10 11 12; U1 2 3 4 7 8 9 10 11 24 27 28 29 33 37 38 50 55 57 61 62; U2 2; U3 2 3 4 5 6 7 8 9 12 14 15 16 17 19 21 22 25; U5 3 9; U6 4; U33 0 CD

## Via types
v1: diameter 0.61, hole 0.305, Top Layer to Bottom Layer, 128 vias

## Routing (per net, layer and track width the routed paths; a pad name or vN(x,y) marks a point on that pad's centre or on a via; arc(x,y) is an arc through that point)
5V: length 83.6
  Top Layer w0.254: D1.2 4.89,13.6 4.89,19.45 5.4,19.95 5.4,22.24 v1(5.14,22.49) ; 118kΩ.2 34.15,22.48 32.3,22.48 32.05,22.22 v1(32.05,20.95) ; U16.2 8.58,33.92 v1(7.56,33.92)
  Inner1 w0.254: 43.48,19.94 42.72,19.94 41.45,21.21 41.19,21.21 ; 43.48,19.94 43.48,15.67 H4.2 H1.2 ; 43.48,19.94 H5.2 ; H6.2 41.19,21.64 41.19,21.21 ; 41.19,21.21 40.94,21.21 40.69,20.95 v1(32.05,20.95) 31.54,21.46 29.76,21.46 29.51,21.72 21.13,21.72 20.35,22.49 v1(5.14,22.49)
  Bottom Layer w0.254: v1(5.14,22.49) 5.14,23 7.56,25.43 v1(7.56,33.92)
5V-USB: length 18.7
  Top Layer w0.254: U6.1 2.99,25.81 2.09,24.91 2.09,22.46 4.38,20.18 4.38,14.84 2.09,12.56 2.09,11.54 D1.1
+3.3V: length 11.3
  Top Layer w0.254: 22.55,8.8 U4.6 ; 22.55,8.8 22.04,8.29 21.53,8.29 21.25,8.58 U4.8 ; 22.55,8.8 23.06,8.29 27.02,8.29 27.88,9.14 ; 27.88,9.14 27.88,8.64 27.75,8.51 C5.1 ; 27.88,9.14 C14.1
GND: length 293.3
  Top Layer w0.254: 28.13,14.99 27.88,14.99 27.37,15.49 27.37,21.19 27.98,21.79 ; 28.13,14.99 28.44,15.29 U1.18 30.52,15.29 31.71,14.1 32.98,14.1 ; 28.13,14.99 28.13,10.67 27.88,10.41 ; v1(23.28,6.44) 24.04,6.44 24.13,6.35 ; 28.74,28.59 28.74,23.06 27.98,22.3 27.98,21.79 ; 28.74,28.59 27.98,29.36 26.7,29.36 ; 28.74,28.59 178kΩ.1 ; 27.98,21.79 U1.31 ; 2.98,26.4 1.34,24.77 U6.6 2.16,20.09 C2.1 ; 2.98,26.4 2.98,26.48 U6.7 ; 2.98,26.4 3.99,26.4 ; 12.65,18.35 C3.1 ; 12.65,18.35 13.33,17.66 13.33,15.74 ; 12.65,18.35 13.33,19.04 13.33,21.07 12.5,21.91 ; 22.78,30.86 U3.18 ; 22.78,30.86 22.78,31.11 23.15,31.48 25.94,31.48 26.7,30.72 26.7,29.36 ; 22.78,30.86 21.76,30.86 18.98,28.07 18.98,27.05 20.5,25.53 U1.47 ; 24.13,6.35 C9.1 24.95,5.59 28.26,5.59 ; 24.13,6.35 23.94,6.15 C6.1 C12.2 ; 12.5,21.91 12.45,21.96 10.92,21.96 9.65,23.23 8.38,23.23 7.37,24.24 U5.7 6.79,23.92 v1(6.79,23.61) ; 12.5,21.91 12.57,21.91 ; 13.33,15.74 15.88,15.74 16.32,15.29 16.57,15.29 ; 13.33,15.74 13.26,15.74 C15.1 8.69,15.05 D2.2 ; 26.7,29.36 26.59,29.47 U3.11 ; U33.6 16.33,37.44 16.33,38.2 ; 3.99,26.4 4.5,26.4 5.52,25.39 5.52,24.88 5.26,24.63 ; 3.99,26.4 U6.9 ; 4.25,22.85 4.75,23.36 4.75,24.12 5.26,24.63 ; 4.25,22.85 4.12,22.85 U6.5 ; 4.25,22.85 3.99,22.59 U6.8 ; 5.26,24.63 v1(5.26,24.37) ; C11.1 31.3,6.48 29.15,6.48 29.02,6.6 28.51,6.6 ; C8.2 28.26,3.56 28.26,5.59 ; H3.2 40.02,42.53 40.01,42.55 38.24,42.55 100Ω#5.1 35.48,43.28 28.01,43.28 26.74,44.55 ; 16.33,38.2 18.87,40.74 20.9,40.74 23.95,43.79 25.98,43.79 26.74,44.55 ; 16.33,38.2 v1(16.08,38.45) ; U1.12 25.5,11.01 26.1,10.41 27.88,10.41 ; CN1.8 26.74,45.06 26.74,44.55 ; 28.26,5.59 28.51,5.84 28.51,6.6 ; 32.98,14.1 8.45kΩ.1 ; 32.98,14.1 v1(32.98,15.11) ; U3.1 22.71,26.66 v1(22.03,26.66) ; MH2.1 40.13,42.55 40.02,42.55 ; 28.76,9.65 28.76,9.14 28.51,8.89 28.51,6.6 ; 28.76,9.65 29.15,9.65 C14.2 ; 28.76,9.65 28.76,9.91 28.26,10.41 27.88,10.41 ; U4.7 21.76,9.2 v1(21.76,9.74) 21.25,10.25 U4.1 21.14,10.61 20.68,10.61 16.57,14.71 16.57,15.29 ; 16.57,15.29 U1.63 ; MH1.1 1.69,45.89 1.69,41.84 4.32,39.21 4.32,36.35 U9.4 v1(6.79,33.88)
  Inner1 w0.254: MH3.1 40.89,6.93 40.89,15.62 ; 40.89,15.62 40.39,15.11 v1(32.98,15.11) ; 40.89,15.62 40.89,19.81 H5.3 ; v1(6.79,33.88) 6.79,34.13 8.56,35.91 11.1,35.91 12.37,37.18 14.81,37.18 v1(16.08,38.45) ; v1(21.76,9.74) 21.76,7.71 ; 21.76,7.71 23.03,6.44 v1(23.28,6.44) ; 21.76,7.71 7.53,7.71 MH4.1 ; v1(5.26,24.37) 6.02,24.37 v1(6.79,23.61) 9.83,26.66 19.99,26.66 20.76,25.9 21.26,25.9 v1(22.03,26.66)
  Bottom Layer w0.254: v1(6.79,33.88) 6.79,33.77 6.02,33.01 6.02,25.39 5.26,24.63 v1(5.26,24.37) ; v1(32.98,15.11) 34.25,15.11 36.03,16.89 36.03,19.01 H6.3
VDD: length 187.3
  Top Layer w0.254: 20,13.81 U1.1 ; 20,13.81 18.98,13.81 U1.64 ; 20,13.81 20.39,14.19 20.76,14.19 ; 18.35,1.8 C13.2 ; 18.35,1.8 16.58,1.8 15.56,2.81 15.56,4.09 15.05,4.59 ; 18.35,1.8 19.37,1.8 19.9,1.27 31.31,1.27 C7.2 v1(33.59,2.79) ; U9.8 1.25,42.66 v1(1.25,41.4) ; v1(30.16,22.8) 30.01,22.8 U1.32 ; 15.05,4.59 15.05,6.12 U2.4 ; 15.05,4.59 14.29,5.36 9.04,5.36 LED1.3 ; 14.33,37.23 14.33,37.99 17.64,41.29 20.69,41.29 23.73,44.34 23.73,46.12 23.99,46.37 34.89,46.37 35.6,45.67 CN1.1 ; 14.33,37.23 14.33,36.32 15.1,35.56 16.88,35.56 10kΩ.2 v1(19.29,34.04) ; 14.33,37.23 U33.4 ; v1(35.54,27.68) 10kΩ#2.2 ; v1(25.89,30.61) 25.38,30.61 U3.13 ; 20.76,14.19 21.52,14.96 21.52,20.04 21.27,20.29 21.27,21.56 20,22.83 U1.48 ; 20.76,14.19 20.89,14.19 21.66,14.96 24.99,14.96 25.97,13.97 25.97,12.7 ; v1(26.23,11.18) 26.23,11.43 25.97,11.68 25.97,12.7 ; 25.97,12.7 U1.13 ; v1(30.92,15.79) U1.19
  Inner1 w0.254: v1(33.59,2.79) 33.59,3.05 26.23,10.41 v1(26.23,11.18) 28.26,13.21 29.27,13.21 30.59,14.52 30.59,15.46 31.1,15.97 ; v1(35.54,27.68) 32.94,30.29 25.67,30.29 25.64,30.32 25.64,30.35 v1(25.89,30.61)
  Inner2 w0.254: v1(19.29,34.04) 19.29,33.91 22.59,30.61 v1(25.89,30.61) ; v1(35.54,27.68) 43.42,35.56 43.42,39.35 H3.1
  Bottom Layer w0.254: v1(30.92,15.79) 30.16,16.55 v1(30.16,22.8) 34.98,27.63 35.49,27.63 v1(35.54,27.68) ; v1(1.25,41.4) 11.92,41.4 v1(19.29,34.04)
+BATT: length 23.5
  Top Layer w0.254: U5.2 7.37,18.48 8.32,17.53 v1(8.57,17.53) ; C9.2 24.07,7.87 v1(22.54,7.87)
  Bottom Layer w0.254: v1(22.54,7.87) 18.23,7.87 v1(8.57,17.53)
BLUE: length 18.8
  Top Layer w0.254: 18,18.8 19.19,18.8 19.45,18.54 v1(19.45,18.03) ; 220Ω.1 32.91,24.64 v1(31.89,23.62)
  Inner2 w0.254: v1(19.45,18.03) 26.81,18.03 27.4,18.62 27.4,19.13 v1(31.89,23.62)
BOOT0: length 77
  Top Layer w0.254: 100Ω#5.2 37.6,39.91 37.37,39.91 ; U1.60 19.27,16.79 v1(20.79,15.27) ; U18.2 35.71,5.11 v1(30.7,5.11) ; 37.37,39.91 38.13,39.14 38.13,37.37 42.19,33.3 42.19,23.65 41.18,22.63 v1(40.92,22.63) ; 37.37,39.91 36.86,40.41 36.61,40.41 35.84,41.18 35.84,42.19 35.33,42.7 33.92,42.7 10kΩ#3.1
  Inner1 w0.254: v1(20.79,15.27) 21.81,15.27 25.62,11.46 25.62,10.44 30.7,5.36 v1(30.7,5.11)
  Bottom Layer w0.254: v1(40.92,22.63) 39.42,21.13 39.42,13.83 v1(30.7,5.11)
CLK: length 20.1
  Top Layer w0.254: v1(15.34,36.16) U33.5 ; v1(19.52,20.55) 19.27,20.29 U1.53
  Inner2 w0.254: v1(19.52,20.55) 15.34,24.73 v1(15.34,36.16)
CMD: length 22.1
  Top Layer w0.254: v1(13.17,35.54) 13.17,37.29 U33.3 ; U1.54 19.27,19.79 v1(19.52,19.54)
  Inner2 w0.254: v1(13.17,35.54) 13.17,25.89 v1(19.52,19.54)
CS_BARO: length 10.1
  Top Layer w0.254: U1.20 28.48,16.29 v1(27.98,15.78) ; v1(22.84,11.27) 22.41,11.27 21.9,10.76 U4.2
  Bottom Layer w0.254: v1(27.98,15.78) 27.36,15.78 v1(22.84,11.27)
CS_FLASH: length 27.8
  Top Layer w0.254: U9.1 1.69,35.17 v1(1.69,34.45) ; U1.45 21.5,23.28 v1(20.99,22.77)
  Bottom Layer w0.254: v1(1.69,34.45) 1.94,34.71 9.05,34.71 v1(20.99,22.77)
GPS_RX: length 35.4
  Top Layer w0.254: CN1.2 34.35,44.65 v1(33.58,43.89) ; v1(27,14.45) U1.15
  Inner2 w0.254: v1(27,14.45) 27,16.73 32.67,22.4 32.67,42.98 v1(33.58,43.89)
GPS_TX: length 36.5
  Top Layer w0.254: CN1.3 33.1,44.65 v1(32.33,43.89) ; v1(26.75,19) 26.75,17.22 25.04,15.52 25.04,15.44 25.12,15.44 26.49,14.07 U1.14
  Inner2 w0.254: v1(28.78,31.7) 29.29,32.21 29.29,40.84 v1(32.33,43.89)
  Bottom Layer w0.254: v1(26.75,19) 27,19 28.78,20.78 v1(28.78,31.7)
GREEN: length 14.5
  Top Layer w0.254: v1(31,19.02) 30.73,19.29 U1.26 ; v1(36.85,26.64) 38.37,28.16 220Ω#3.1
  Bottom Layer w0.254: v1(36.85,26.64) 31,20.8 v1(31,19.02)
GYRO_SCL: length 15.3
  Top Layer w0.254: 4.7kΩ#4.2 27.04,42.55 28.94,42.55 29.19,42.29 29.19,40.77 29.45,40.51 32.24,40.51 33.92,38.84 33.92,35.53 4.7kΩ.2
GYRO_SDA: length 11.3
  Top Layer w0.254: 4.7kΩ#3.2 25,37.08 24.62,37.08 18.27,30.73 4.7kΩ#2.2
MISO_BARO: length 16
  Top Layer w0.254: U4.3 22.55,10.25 23.06,9.74 24.23,9.74 v1(25,10.5) ; U1.22 30.52,17.29 v1(31.02,16.78)
  Inner2 w0.254: v1(31.02,16.78) 29.75,15.51 29.75,11.45 28.81,10.5 v1(25,10.5)
MISO_FLASH: length 30.4
  Top Layer w0.254: v1(9.99,37.75) 9.99,38.01 5.1,42.9 U9.5 ; v1(25.23,25.82) 25.99,25.82 26.5,25.31 U1.35
  Inner2 w0.254: v1(25.23,25.82) 23.7,27.34 20.91,27.34 19.39,28.86 v1(19.39,29.37)
  Bottom Layer w0.254: v1(9.99,37.75) 18.37,29.37 v1(19.39,29.37)
MOSI_BARO: length 17.2
  Top Layer w0.254: U4.5 23.3,9.16 v1(24.83,9.16) ; U1.23 30.92,17.79 31.68,17.03 31.68,15.51 v1(32.19,15)
  Inner2 w0.254: v1(32.19,15) 32.19,13.22 28.13,9.16 v1(24.83,9.16)
MOSI_FLASH: length 34.3
  Top Layer w0.254: U1.36 v1(26,22.51) ; U9.6 3.56,41.91 4.92,40.55 4.92,38.77 6.95,36.74 v1(9.74,36.74)
  Bottom Layer w0.254: v1(26,22.51) 23.46,25.05 21.43,25.05 v1(9.74,36.74)
MOTOR1: length 29.6
  Top Layer w0.254: 100Ω.2 42.67,34.78 42.67,26.42 44.7,24.38 44.7,12.7 H1.1
MOTOR2: length 30.1
  Top Layer w0.254: v1(33.27,36.05) 31.75,36.05 30.23,37.58 30.23,38.08 100Ω#2.2
  Inner2 w0.254: v1(33.27,36.05) 33.27,29.08 35.31,27.05 35.56,27.05 42.16,20.45 42.16,19.43 H4.1
MOTOR3: length 33.2
  Top Layer w0.254: 100Ω#3.2 30.28,41.53 v1(31.62,41.53)
  Inner1 w0.254: H5.1 44.83,21.21 44.83,31.62 45.85,32.64 45.85,33.15 44.83,34.16 38.99,34.16 v1(31.62,41.53)
MOTOR4: length 18.8
  Top Layer w0.254: v1(34.78,35.83) 100Ω#4.2
  Bottom Layer w0.254: H6.1 46.1,24.51 v1(34.78,35.83)
RED: length 21
  Top Layer w0.254: 220Ω#2.1 37.1,31.88 v1(35.32,30.1) ; v1(28.12,18.79) U1.25
  Bottom Layer w0.254: v1(28.12,18.79) 29.5,20.17 29.5,24.28 v1(35.32,30.1)
SCK_BARO: length 10.9
  Top Layer w0.254: v1(24.67,11.2) 23.9,11.2 U4.4 ; U1.21 v1(27.98,16.79)
  Bottom Layer w0.254: v1(27.98,16.79) 28.74,16.03 28.74,15.27 v1(24.67,11.2)
SCK_FLASH: length 31.6
  Top Layer w0.254: v1(14.55,26.07) 14.55,26.58 8.46,32.67 5.66,32.67 4.14,34.2 3.42,34.2 2.4,35.21 2.4,35.72 U9.2 ; U1.34 v1(27,25.82)
  Inner1 w0.254: v1(14.55,26.07) 15.57,25.05 26.24,25.05 v1(27,25.82)
SD_DAT0: length 16.2
  Top Layer w0.254: U1.39 24.5,25.56 v1(24.25,25.82) ; v1(19.67,34.71) 18.91,35.47 18.4,35.47 17.54,36.33 U33.7
  Inner1 w0.254: v1(24.25,25.82) 24.25,30.13 v1(19.67,34.71)
SD_DAT1: length 19.2
  Top Layer w0.254: U1.40 24,23.28 v1(24.51,22.77) ; v1(18.64,36.21) U33.8
  Inner2 w0.254: v1(24.51,22.77) 21.46,25.82 20.7,25.82 18.64,27.87 v1(18.64,36.21)
SD_DAT2: length 24.5
  Top Layer w0.254: U1.51 19.02,21.29 v1(19.52,21.8) ; v1(12.21,38.59) 11.7,38.59 10.94,37.83 U33.1
  Inner2 w0.254: v1(19.52,21.8) 15.97,25.36 15.97,36.36 13.73,38.59 v1(12.21,38.59)
SD_DAT3: length 19.7
  Top Layer w0.254: U33.2 12.04,36.54 v1(12.55,36.03) ; v1(16.48,21.05) 16.73,20.79 U1.52
  Inner2 w0.254: v1(16.48,21.05) 12.55,24.97 v1(12.55,36.03)
SWCLK: length 31.3
  Top Layer w0.254: v1(18.67,23.5) 18.67,22.96 U1.49
  Inner1 w0.254: v1(18.67,23.5) 19.41,24.23 35.92,24.23 H3.4
SWDIO: length 31.9
  Top Layer w0.254: U1.46 20.95,24.34 v1(20.95,26.54)
  Bottom Layer w0.254: v1(20.95,26.54) 21.97,27.56 21.97,28.32 31.37,37.72 42.29,37.72 H3.3
$1N1: length 24.9
  Top Layer w0.254: v1(29.13,14.28) 29.13,14.43 U1.17 ; v1(29.5,25.35) 29.75,25.6 29.75,29.67 26.02,33.4 22Ω#2.2
  Inner1 w0.254: v1(29.13,14.28) 29.13,16.82 27.47,18.49 27.47,19.25 v1(26.7,20.02)
  Inner2 w0.254: v1(26.7,20.02) 27.47,20.78 27.47,21.28 29.5,23.32 v1(29.5,25.35)
$1N2: length 24.2
  Top Layer w0.254: v1(4.86,25.16) U6.2 ; 22Ω#2.1 23.77,34.67 v1(19.45,30.35)
  Inner1 w0.254: v1(4.86,25.16) 10.05,30.35 v1(19.45,30.35)
$1N3: length 28.5
  Top Layer w0.254: U1.16 27.54,12.75 v1(27.54,11.22) ; 22Ω.2 30.08,34.42 30.08,31.11 31.86,29.34 31.86,28.07 30.85,27.05 30.85,20.19 31.61,19.43 v1(31.61,18.16)
  Inner1 w0.254: v1(27.54,11.22) 28.89,12.57 29.32,12.57 31.61,14.86 v1(31.61,18.16)
$1N4: length 31.6
  Top Layer w0.254: 22Ω.1 v1(27.07,34.67) ; v1(2.68,24.46) 3.7,24.46 U6.3
  Inner1 w0.254: v1(27.07,34.67) 26.3,35.43 13.91,35.43 2.94,24.46 v1(2.68,24.46)
$1N7: length 31.2
  Top Layer w0.254: v1(28.07,20.98) 28.38,21.29 U1.30 ; C2.2 v1(3.68,16.66)
  Bottom Layer w0.254: v1(28.07,20.98) 27.56,21.49 20.7,21.49 19.69,22.5 9.52,22.5 v1(3.68,16.66)
$1N9: length 32.4
  Top Layer w0.254: v1(12.32,20.51) 12.57,20.26 C3.2 ; U1.5 22,11.7 v1(21.56,11.27) ; v1(6.73,26.1) 6.73,28.67 X1.2
  Inner1 w0.254: v1(12.32,20.51) v1(21.56,11.27)
  Inner2 w0.254: v1(12.32,20.51) v1(6.73,26.1)
$1N10: length 31.6
  Top Layer w0.254: v1(2.67,28.13) 2.67,30.01 X1.1 ; v1(21.82,14.24) 22.07,14.24 22.5,13.81 U1.6 ; v1(12.32,17.21) 12.32,16.96 12.57,16.7 C15.2
  Inner2 w0.254: v1(21.82,14.24) 15.29,14.24 v1(12.32,17.21) 11.3,17.21 2.41,26.1 2.41,27.88 v1(2.67,28.13)
$1N15: length 39.1
  Top Layer w0.254: U3.10 26.51,28.97 28.05,27.43 28.05,23.37 26.02,21.34 26.02,17.53 v1(25.77,17.27) ; C8.1 v1(27.62,4.57)
  Bottom Layer w0.254: v1(27.62,4.57) 31.18,8.13 31.18,8.89 30.16,9.91 22.97,9.91 22.21,10.67 22.21,13.72 v1(25.77,17.27)
$1N18: length 11.7
  Top Layer w0.254: C7.1 30.42,1.78 21.4,1.78 C12.1
$1N20: length 33.5
  Top Layer w0.254: U3.20 21.26,29.47 v1(19.6,27.81) ; v1(24.58,4.95) 25.34,4.19 C6.2 ; v1(20.77,16.13) 20.77,21.46 19.5,22.73 19.5,25.63 v1(17.82,27.31)
  Inner1 w0.254: v1(17.82,27.31) 19.09,27.31 v1(19.6,27.81) ; v1(20.77,16.13) 20,15.37 20,15.11 24.07,11.05 24.07,5.46 v1(24.58,4.95)
$1N23: length 52
  Top Layer w0.254: v1(30.55,8.51) 31.82,8.51 C1.2 ; C13.1 17.72,3.43 20.39,3.43 22.67,5.72 22.67,7.24 ; v1(5.27,11.18) 3.75,9.65 2.73,9.65 D1.3 ; v1(23.43,7.24) 22.67,7.24 ; 22.67,7.24 21.9,7.24 U2.1
  Inner2 w0.254: v1(23.43,7.24) 9.21,7.24 v1(5.27,11.18)
  Bottom Layer w0.254: v1(23.43,7.24) 24.7,8.51 v1(30.55,8.51)
$1N24: length 21.8
  Top Layer w0.254: C1.1 v1(29.14,11.81) ; U2.3 14.21,13.38 15.64,13.38 16.15,12.87 v1(16.15,11.85)
  Inner2 w0.254: v1(16.15,11.85) 16.4,12.11 28.85,12.11 v1(29.14,11.81)
$1N49: length 14.5
  Top Layer w0.254: U9.3 3.56,35.45 5.73,33.27 15.64,33.27 10kΩ.1
$1N50: length 38.8
  Top Layer w0.254: v1(30.75,31.37) 33.29,28.83 10kΩ#2.1 ; v1(20.59,42.04) 18.3,44.32 3.32,44.32 2.29,43.29 U9.7
  Inner1 w0.254: v1(20.59,42.04) 30.75,31.88 v1(30.75,31.37)
$1N54: length 16.8
  Top Layer w0.254: 100Ω#2.1 28.21,36.58 29.23,35.56 29.23,33.27 v1(28.46,32.51) ; v1(23.13,25.65) 23,25.52 U1.42
  Bottom Layer w0.254: v1(28.46,32.51) 26.69,30.73 26.69,29.21 v1(23.13,25.65)
$1N55: length 30.3
  Top Layer w0.254: v1(31.55,32.33) 31.3,32.58 31.3,35.47 31.04,35.72 30.79,35.72 29.26,37.24 29.26,38.77 28.25,39.78 100Ω#3.1 ; U1.43 22.5,22.84 24.69,20.64 v1(25.2,20.64)
  Inner2 w0.254: v1(25.2,20.64) 28.76,24.2 28.76,25.47 29.26,25.98 29.52,25.98 31.55,28.01 v1(31.55,32.33)
$1N56: length 18.4
  Top Layer w0.254: v1(22.37,25.91) 22,25.54 U1.44 ; 100Ω#4.1 v1(31.77,37.08)
  Bottom Layer w0.254: v1(22.37,25.91) 22.62,26.16 22.62,28.19 31.51,37.08 v1(31.77,37.08)
$1N58: length 8.7
  Top Layer w0.254: 4.7kΩ#2.1 16.27,29.21 v1(17.29,28.19) ; v1(20.18,27.22) 21.77,27.22 U3.24
  Inner1 w0.254: v1(17.29,28.19) 17.54,28.45 20.08,28.45 20.34,28.19 20.34,27.38 v1(20.18,27.22)
$1N60: length 15.2
  Top Layer w0.254: v1(21.26,28.07) 21.35,27.97 U3.23 ; 4.7kΩ.1 32.78,34.42 v1(32.02,33.66)
  Inner2 w0.254: v1(32.02,33.66) 26.43,28.07 v1(21.26,28.07)
$1N63: length 37.3
  Top Layer w0.254: U1.58 16.98,17.79 16.55,18.22 v1(16.55,20.15) ; 4.7kΩ#4.1 v1(21.99,39.5)
  Inner1 w0.254: v1(16.55,20.15) 18.04,18.67 20.21,18.67 v1(21.99,20.45)
  Inner2 w0.254: v1(21.99,39.5) 20.97,39.5 16.65,35.18 16.65,26.54 19.45,23.75 19.45,22.99 v1(21.99,20.45)
$1N64: length 27.2
  Top Layer w0.254: U1.59 16.89,17.29 15.97,18.21 15.97,20.75 15.38,21.34 15.38,30.99 15.64,31.24 17.42,31.24 24.02,37.85 4.7kΩ#3.1
$1N71: length 32.3
  Top Layer w0.254: v1(36.72,24.04) 36.72,25.53 36.21,26.03 36.21,27.81 36.47,28.07 36.47,28.58 37.99,30.1 37.99,35.43 37.23,36.2 100Ω.1 ; v1(23.51,22.77) 23.51,24.28 U1.41
  Inner1 w0.254: v1(23.51,22.77) 24.27,23.53 28.59,23.53 30.11,22.01 35.2,22.01 36.72,23.53 v1(36.72,24.04)
$1N83: length 21.1
  Top Layer w0.254: C16.2 18.1,10.16 14.54,10.16 13.78,10.92 v1(13.78,11) ; v1(8.45,16.33) 8.19,16.33 6.16,18.36 6.16,18.62 6.1,18.68
  Inner1 w0.254: v1(13.78,11) v1(8.45,16.33)
$1N84: length 37.1
  Top Layer w0.254: U16.1 9.59,27.93 9.4,27.93 6.1,24.63 6.1,24.38 5.84,24.12 5.84,19.81 5.33,19.3 5.33,12.95 7.87,10.41 D2.1 8.39,7.87 18.98,7.87 C16.1
$1N87: length 32.9
  Top Layer w0.254: v1(34.92,16.7) 34.92,17.65 32.4kΩ.2 ; v1(15.37,20.51) C10.2 10.36,25.51 9.52,25.51 8.64,24.63 8.64,24.5
  Bottom Layer w0.254: v1(34.92,16.7) 32.89,16.7 31.37,15.18 30.61,15.18 27.81,17.97 20.45,17.97 19.69,18.73 17.14,18.73 v1(15.37,20.51)
$1N88: length 12.4
  Top Layer w0.254: 32.4kΩ.1 33.09,16 34.1,14.99 34.1,7.62 C11.2
$1N90: length 25.4
  Top Layer w0.254: 178kΩ.2 30.85,28.19 v1(30.34,27.69) ; v1(11.54,18.8) 10.02,18.8 U5.4
  Inner2 w0.254: v1(11.54,18.8) 21.45,18.8 v1(30.34,27.69)
$1N93: length 43.7
  Top Layer w0.254: v1(10.66,23.24) 10.66,23.75 U5.5 ; 8.45kΩ.2 35.16,14.61 34.15,15.62 34.15,18.42 v1(33.39,19.18) 33.39,21.24 118kΩ.1
  Inner2 w0.254: v1(10.66,23.24) 12.94,20.95 12.94,20.19 12.43,19.69 11.42,19.69 10.91,19.18 10.91,18.42 11.16,18.16 13.32,18.16 14.08,17.4 20.43,17.4 23.99,13.84 27.25,13.84 30.8,17.4 31.86,17.4 33.39,18.92 v1(33.39,19.18)
$1N107: length 34.1
  Top Layer w0.254: v1(34.54,33.35) 34.54,27 36.07,25.48 36.07,10.75 U18.1 ; v1(34.8,39.45) 34.8,41.57
  Inner2 w0.254: v1(34.8,39.45) 34.04,38.69 34.04,33.86 v1(34.54,33.35)
$1N112: length 48.6
  Top Layer w0.254: v1(36.71,16.78) 39.25,19.32 39.25,34.52 220Ω#2.2 ; LED1.2 13.34,2.3 v1(14.86,3.82)
  Inner2 w0.254: v1(14.86,3.82) 16.9,5.85 25.79,5.85 v1(36.71,16.78)
$1N113: length 60
  Top Layer w0.254: 220Ω#3.2 39.75,28.21 39.75,2.81 37.71,0.77 9.01,0.77 LED1.1
$1N114: length 41.1
  Top Layer w0.254: LED1.4 13.09,4.05 v1(12.58,4.56) ; v1(35.16,22.83) 220Ω.2
  Inner2 w0.254: v1(12.58,4.56) 14.1,3.04 24.01,3.04 37.45,16.48 37.45,20.54 v1(35.16,22.83)

## Copper pours and planes (outline as drawn; the poured copper is in the pictures)
GND on Top Layer: 0,49.75 47.5,49.75 47.5,0.25 0,0.25
GND on Inner1: 0,50.04 47.43,50.04 47.43,0 0,0
